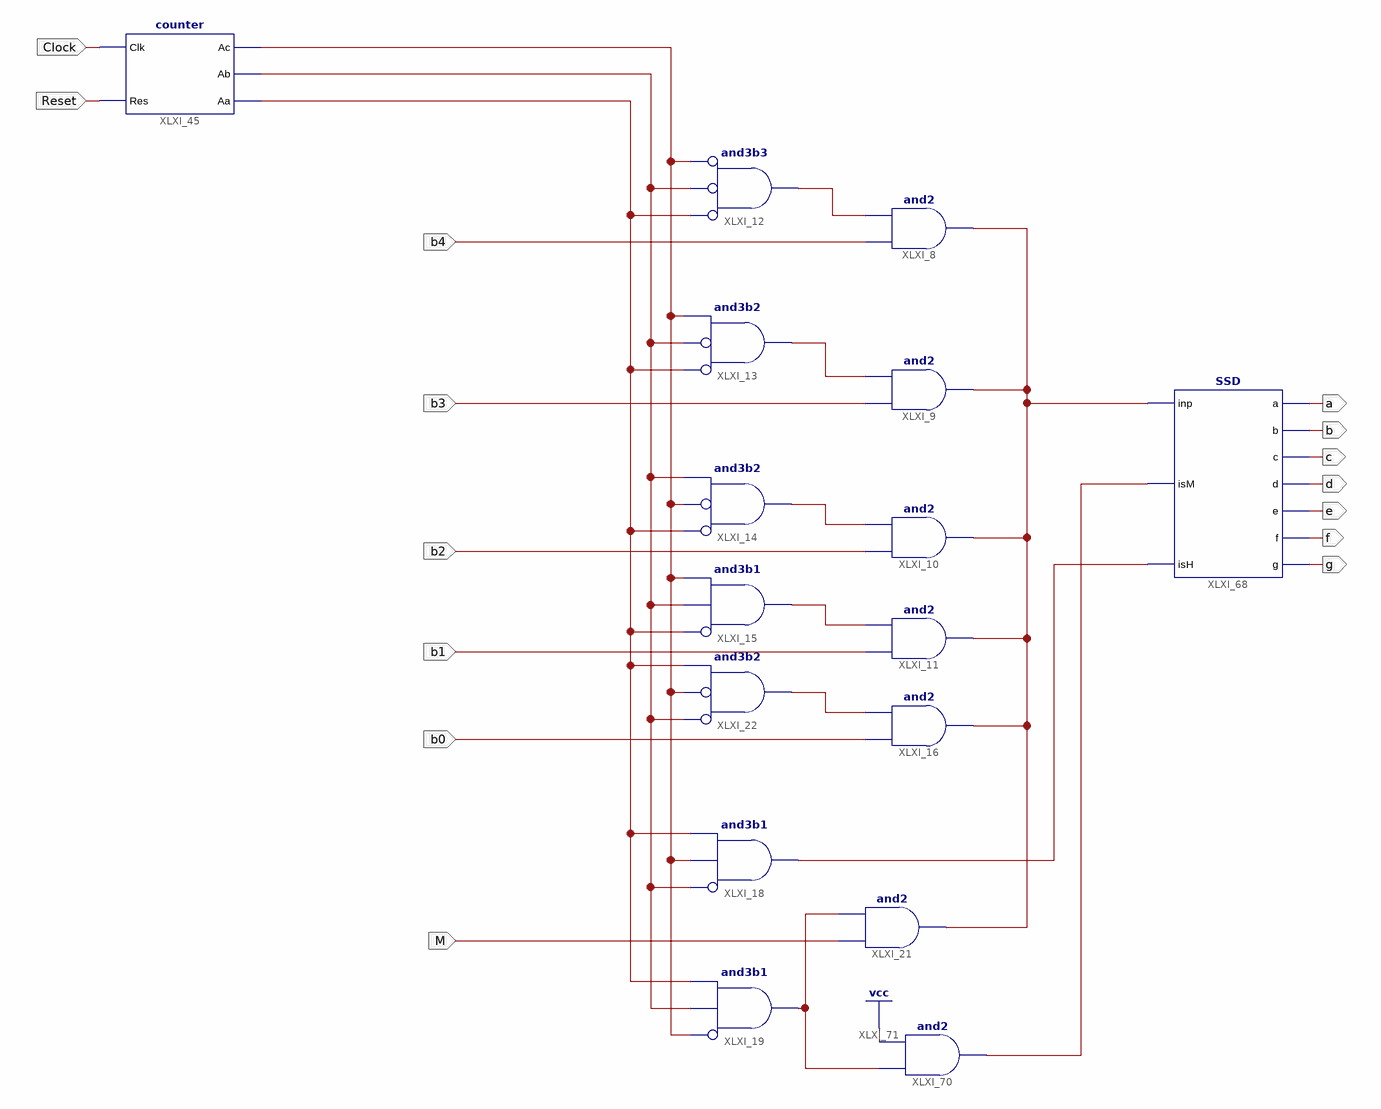
[diagram p0: schematic sheet 1]
// Xilinx ISE schematic decoder.sch (xc9500xl) as structural Verilog: 16 symbols, 15 ports
module decoder (
  input  Clock,
  input  Reset,
  input  b4,
  input  b3,
  input  b2,
  input  b1,
  input  b0,
  input  M,
  output a,
  output b,
  output c,
  output d,
  output e,
  output f,
  output g
);

  wire XLXN_9, XLXN_10, XLXN_11, XLXN_22, XLXN_23, XLXN_24, XLXN_25, XLXN_26, XLXN_27, XLXN_45, XLXN_50,
       XLXN_56;

  and XLXI_8 (XLXN_50, b4, XLXN_23);
  and XLXI_9 (XLXN_50, b3, XLXN_24);
  and XLXI_10 (XLXN_50, b2, XLXN_25);
  and XLXI_11 (XLXN_50, b1, XLXN_26);
  and XLXI_12 (XLXN_23, ~XLXN_9, ~XLXN_10, ~XLXN_11);  // and3b3
  and XLXI_13 (XLXN_24, ~XLXN_9, ~XLXN_10, XLXN_11);  // and3b2
  and XLXI_15 (XLXN_26, ~XLXN_9, XLXN_10, XLXN_11);  // and3b1
  and XLXI_16 (XLXN_50, b0, XLXN_27);
  and XLXI_14 (XLXN_25, ~XLXN_9, ~XLXN_11, XLXN_10);  // and3b2
  and XLXI_19 (XLXN_22, ~XLXN_11, XLXN_10, XLXN_9);  // and3b1
  and XLXI_21 (XLXN_50, M, XLXN_22);
  and XLXI_18 (XLXN_45, ~XLXN_10, XLXN_11, XLXN_9);  // and3b1
  and XLXI_22 (XLXN_27, ~XLXN_10, ~XLXN_11, XLXN_9);  // and3b2
  counter XLXI_45 (.Clk(Clock), .Res(Reset), .Ac(XLXN_11), .Ab(XLXN_10), .Aa(XLXN_9));
  SSD XLXI_68 (.inp(XLXN_50), .isM(XLXN_56), .isH(XLXN_45), .a(a), .b(b), .c(c), .d(d), .e(e), .f(f), .g(g));
  and XLXI_70 (XLXN_56, XLXN_22, 1'b1);
endmodule
